# EAGLE design V3 (EAGLE 9.5.2)
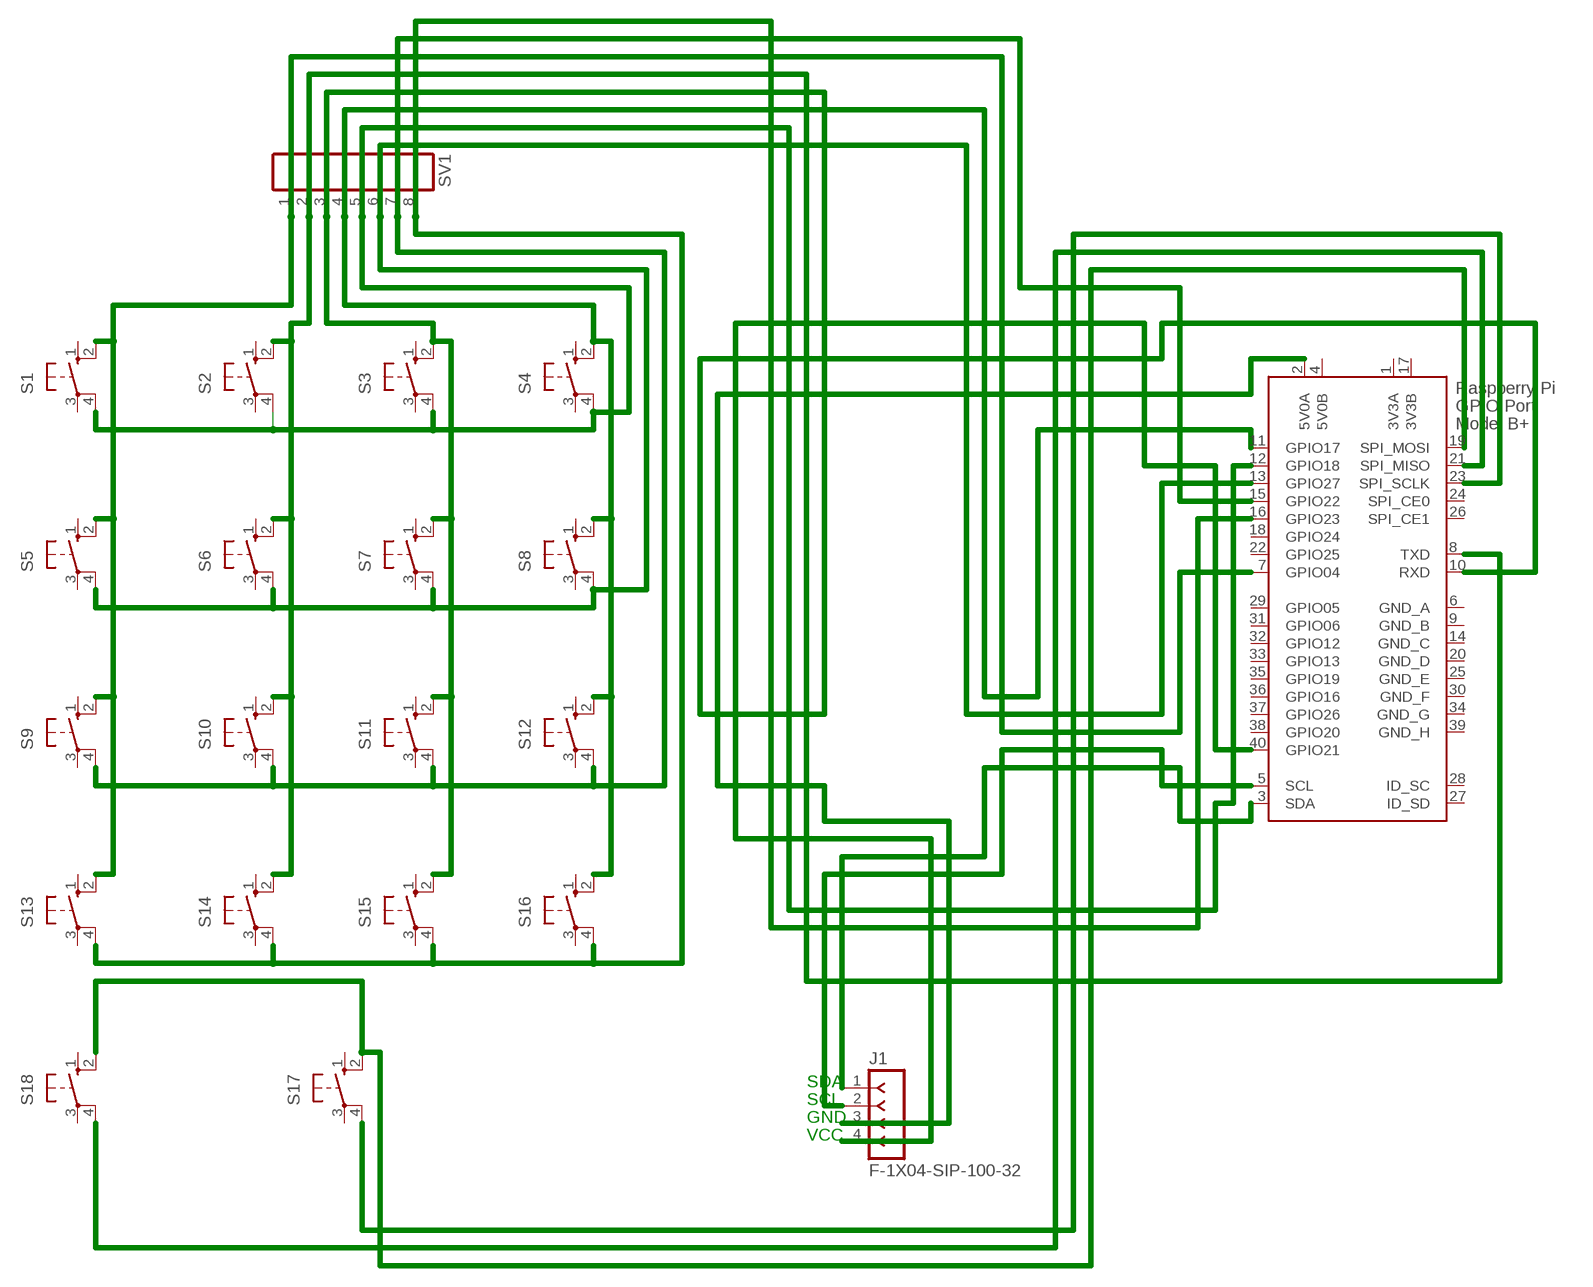
[diagram p0: schematic, sheet 1]

## Parts
J1  F-1X04-SIP-100-32  [SIP-100-04-32]
S1  40-XX  [B3F-40XX]
S2  40-XX  [B3F-40XX]
S3  40-XX  [B3F-40XX]
S4  40-XX  [B3F-40XX]
S5  40-XX  [B3F-40XX]
S6  40-XX  [B3F-40XX]
S7  40-XX  [B3F-40XX]
S8  40-XX  [B3F-40XX]
S9  40-XX  [B3F-40XX]
S10  40-XX  [B3F-40XX]
S11  40-XX  [B3F-40XX]
S12  40-XX  [B3F-40XX]
S13  40-XX  [B3F-40XX]
S14  40-XX  [B3F-40XX]
S15  40-XX  [B3F-40XX]
S16  40-XX  [B3F-40XX]
S17  40-XX  [B3F-40XX]
S18  40-XX  [B3F-40XX]
SV1  MA08-1  [MA08-1]
X1  RASPI_GPIO_B+#_PIN  [RASPI_GPIO_B+_PIN]

## Nets
N$1: S1.2(S1) S5.2(S1) S9.2(S1) S13.2(S1) SV1.1 X1.7(GPIO04)
N$2: S2.2(S1) S6.2(S1) S10.2(S1) S14.2(S1) SV1.2 X1.8(TXD)
N$3: S3.2(S1) S7.2(S1) S11.2(S1) S15.2(S1) SV1.3 X1.10(RXD)
N$4: J1.4 X1.40(GPIO21)
N$5: S13.4(P1) S14.4(P1) S15.4(P1) S16.4(P1) SV1.8 X1.16(GPIO23)
N$6: S9.4(P1) S10.4(P1) S11.4(P1) S12.4(P1) SV1.7 X1.15(GPIO22)
N$7: S5.4(P1) S6.4(P1) S7.4(P1) S8.4(P1) SV1.6 X1.13(GPIO27)
N$8: S1.4(P1) S2.4(P1) S3.4(P1) S4.4(P1) SV1.5 X1.12(GPIO18)
N$9: S17.2(S1) S18.2(S1) X1.19(SPI_MOSI)
N$10: S18.4(P1) X1.21(SPI_MISO)
N$11: S17.4(P1) X1.23(SPI_SCLK)
N$15: J1.1 X1.3(SDA)
N$16: J1.2 X1.5(SCL)
N$18: J1.3 X1.2(5V0A)
N$19: S4.2(S1) S8.2(S1) S12.2(S1) S16.2(S1) SV1.4 X1.11(GPIO17)
Unconnected: S1.1(S) S1.3(P) S2.1(S) S2.3(P) S3.1(S) S3.3(P) S4.1(S) S4.3(P) S5.1(S) S5.3(P) S6.1(S) S6.3(P) S7.1(S) S7.3(P) S8.1(S) S8.3(P) S9.1(S) S9.3(P) S10.1(S) S10.3(P) S11.1(S) S11.3(P) S12.1(S) S12.3(P) S13.1(S) S13.3(P) S14.1(S) S14.3(P) S15.1(S) S15.3(P) S16.1(S) S16.3(P) S17.1(S) S17.3(P) S18.1(S) S18.3(P) X1.18(GPIO24) X1.22(GPIO25) X1.24(SPI_CE0) X1.26(SPI_CE1) X1.27(ID_SD) X1.28(ID_SC) X1.29(GPIO05) X1.31(GPIO06) X1.32(GPIO12) X1.33(GPIO13) X1.35(GPIO19) X1.36(GPIO16) X1.37(GPIO26) X1.38(GPIO20)

## Notes on the sheet
- SDA
- SCL
- GND
- VCC

## Power pins joined to a net without a drawn wire
3V3A: X1.1(3V3A)
3V3B: X1.17(3V3B)
5V0B: X1.4(5V0B)
GND_A: X1.6(GND_A)
GND_B: X1.9(GND_B)
GND_C: X1.14(GND_C)
GND_D: X1.20(GND_D)
GND_E: X1.25(GND_E)
GND_F: X1.30(GND_F)
GND_G: X1.34(GND_G)
GND_H: X1.39(GND_H)

## Library data of the parts
J1 = con-headers-jp:F-1X04-: FEMALE HEADER
S1-S18 = switch-omron:40-XX: OMRON SWITCH; MF: OMRON COMPONENTS USA; MPN: B3F-4000; OC_FARNELL: 176434; OC_NEWARK: 36K3105
SV1 = con-lstb:MA08-1: PIN HEADER; OC_FARNELL: unknown; OC_NEWARK: unknown
X1 = raspberrypi_bastelstube_v13:RASPI_GPIO_B+#: 2x20 header connector, all pins connected

## Net classes
0 default: width 0.33 mm, clearance 0.33 mm

## Board
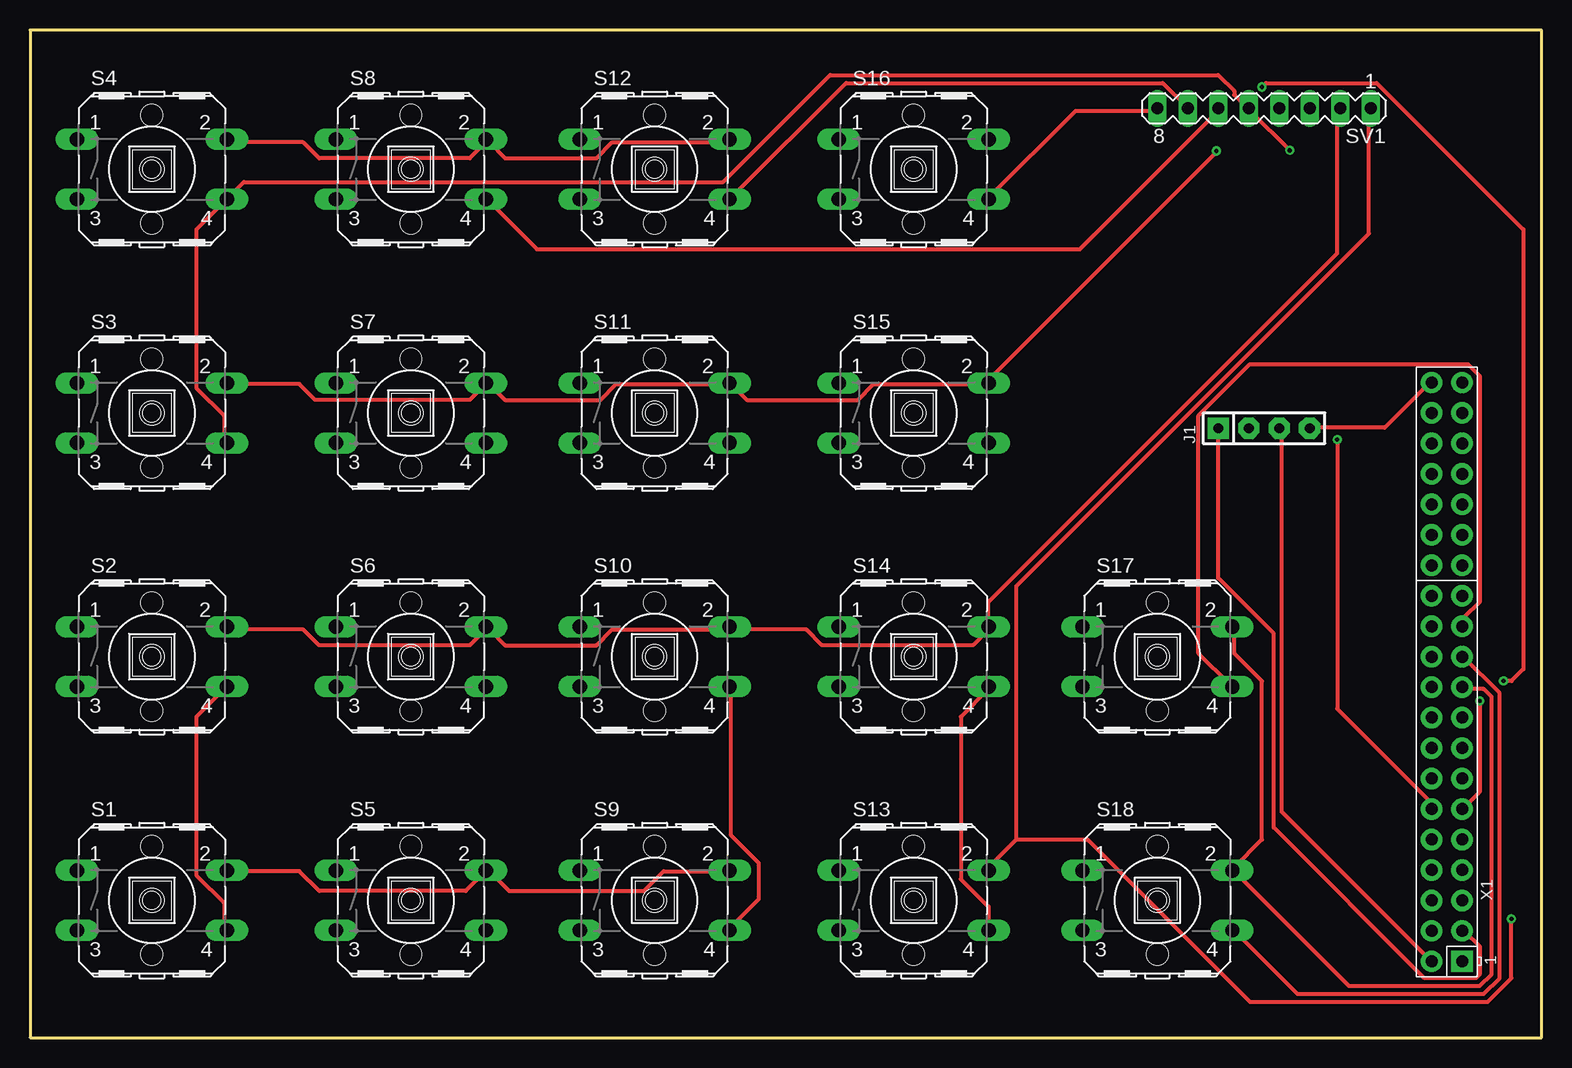
[diagram p1: board, top side]
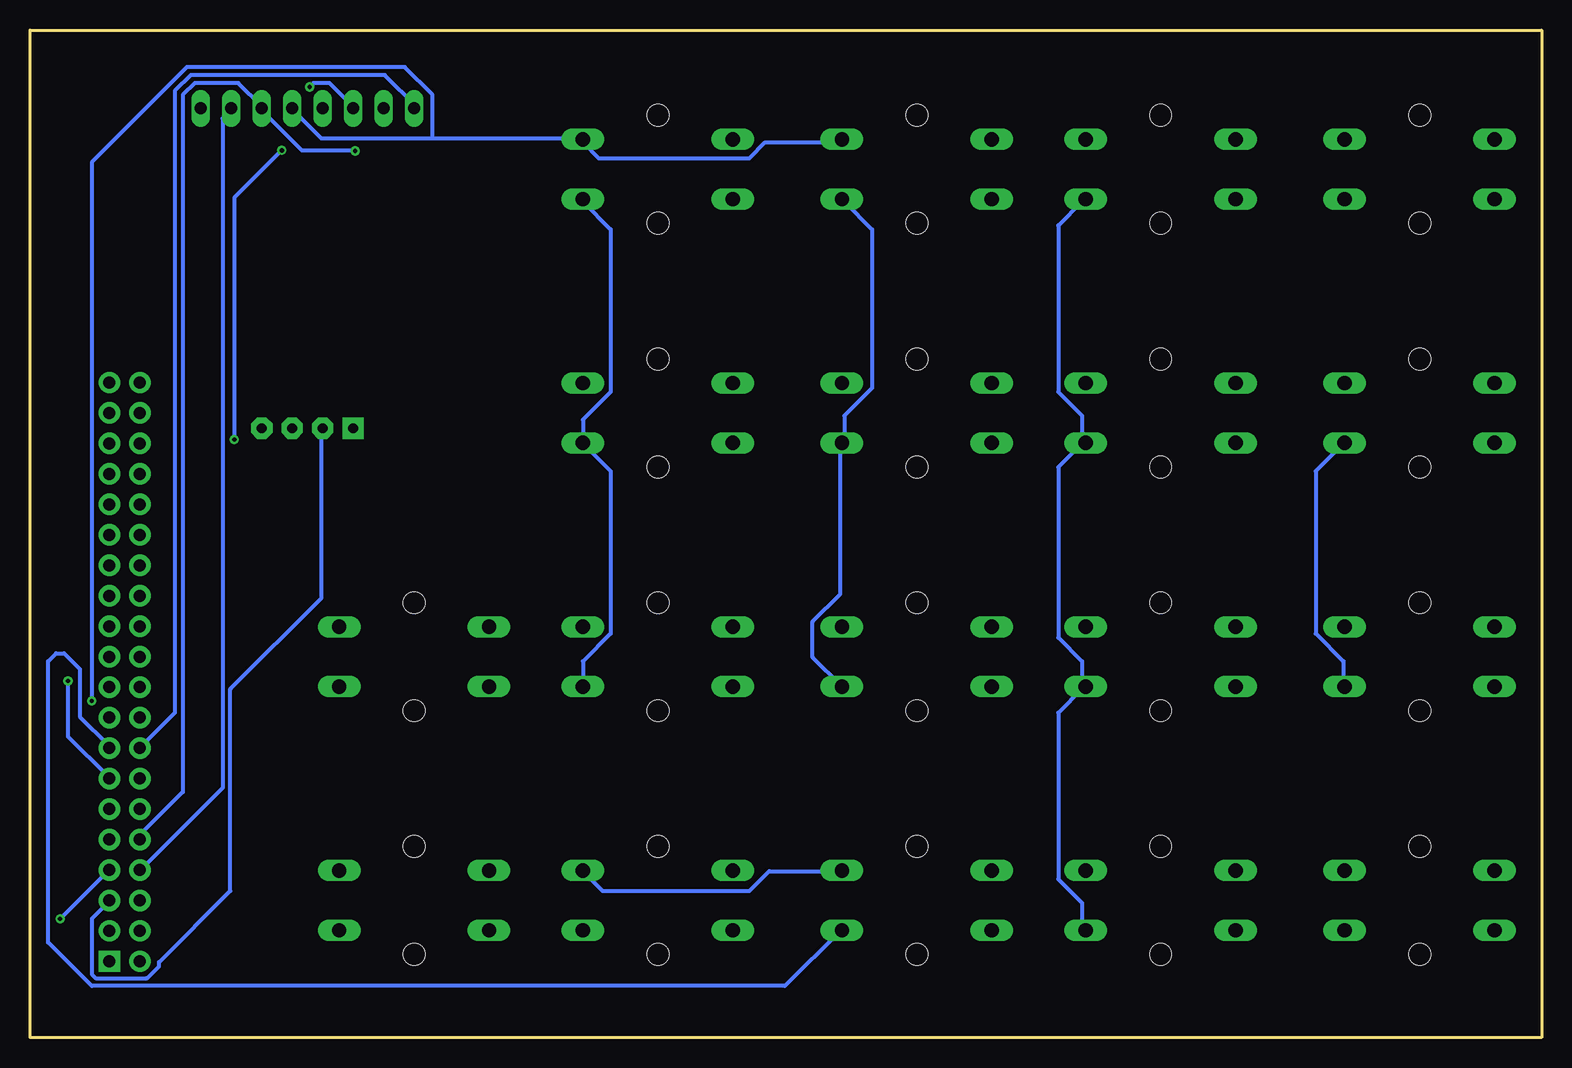
[diagram p2: board, bottom side, seen from below]

Size 126 x 84 mm. Coordinates in mm from the lower left corner, seen from the top.
Outline: 0,84 0,0 126,0 126,84 0,84
Copper layers (1*16): Top 0.035mm / dielectric 1.5mm / Bottom 0.035mm
Design rules "default *": minimum track width 6mil, minimum drill 0.35mm, track to track 13mil, track to pad 13mil, pad to pad 13mil, via to via 13mil, smd to smd 13mil, copper to edge 40mil, drill to drill 6mil, minimum pad ring 10mil, minimum via ring 8mil, stop-mask expansion 4mil, vias tented up to drill 0mil, thermal gap 10mil

### Footprints (pad centres in the part's own frame; a part is rotated, then mirrored left to right if it is on the bottom)
SIP-100-04-32 = drill 0.813 pad 1.778 square: 1 -3.81,0 | drill 0.813 pad 1.778 octagon: 2 -1.27,0; 3 1.27,0; 4 3.81,0
B3F-40XX = drill 1.194 long: 1 -6.248,2.489; 2 6.248,2.489; 3 -6.248,-2.489; 4 6.248,-2.489 | hole 1.803: 0,-4.496; 0,4.496
MA08-1 = drill 1.016 long: 1 -8.89,0; 2 -6.35,0; 3 -3.81,0; 4 -1.27,0; 5 1.27,0; 6 3.81,0; 7 6.35,0; 8 8.89,0
RASPI_GPIO_B+_PIN = drill 1 pad 1.778 square: 1 -24.13,-1.27 | drill 1 pad 1.778: 2 -24.13,1.27; 3 -21.59,-1.27; 4 -21.59,1.27; 5 -19.05,-1.27; 6 -19.05,1.27; 7 -16.51,-1.27; 8 -16.51,1.27; 9 -13.97,-1.27; 10 -13.97,1.27; 11 -11.43,-1.27; 12 -11.43,1.27; 13 -8.89,-1.27; 14 -8.89,1.27; 15 -6.35,-1.27; 16 -6.35,1.27; 17 -3.81,-1.27; 18 -3.81,1.27; 19 -1.27,-1.27; 20 -1.27,1.27; 21 1.27,-1.27; 22 1.27,1.27; 23 3.81,-1.27; 24 3.81,1.27; 25 6.35,-1.27; 26 6.35,1.27; 27 8.89,-1.27; 28 8.89,1.27; 29 11.43,-1.27; 30 11.43,1.27; 31 13.97,-1.27; 32 13.97,1.27; 33 16.51,-1.27; 34 16.51,1.27; 35 19.05,-1.27; 36 19.05,1.27; 37 21.59,-1.27; 38 21.59,1.27; 39 24.13,-1.27; 40 24.13,1.27

### Placement (x,y rotation side)
J1  102.87,50.8 0 top
S1  10.16,11.43 0 top
S2  10.16,31.75 0 top
S3  10.16,52.07 0 top
S4  10.16,72.39 0 top
S5  31.75,11.43 0 top
S6  31.75,31.75 0 top
S7  31.75,52.07 0 top
S8  31.75,72.39 0 top
S9  52.07,11.43 0 top
S10  52.07,31.75 0 top
S11  52.07,52.07 0 top
S12  52.07,72.39 0 top
S13  73.66,11.43 0 top
S14  73.66,31.75 0 top
S15  73.66,52.07 0 top
S16  73.66,72.39 0 top
S17  93.98,31.75 0 top
S18  93.98,11.43 0 top
SV1  102.87,77.47 180 top
X1  118.11,30.48 90 top

### Tracks (layer width: path | path; a pad name or v marks a point on that pad's centre or on a via)
N$1  (via drill 0.35)
  Top 0.33: S1.2 16.51,13.87 22.45,13.87 24.11,12.22 36.32,12.22 37.97,13.87 S5.2 38.3,13.87 39.95,12.22 51.18,12.22 52.83,13.87 58.12,13.87 S9.2 | 82.22,16.51 82.22,37.64 111.61,67.03 111.61,77.27 SV1.1 | 82.22,16.51 79.91,14.2 S13.2 | v123.5,9.91 123.5,4.95 121.51,2.97 101.7,2.97 88.16,16.51 82.22,16.51
  Bottom 0.33: v123.5,9.91 119.53,13.87 X1.7 | S9.2 58.45,13.87 64.39,13.87 66.04,12.22 78.26,12.22 79.91,13.87 S13.2
N$2
  Top 0.33: S2.2 16.51,34.01 22.78,34.01 24.11,32.69 36.65,32.69 37.97,34.01 S6.2 38.3,34.01 39.62,32.69 47.22,32.69 48.54,34.01 58.12,34.01 S10.2 58.45,34.01 64.72,34.01 66.04,32.69 78.59,32.69 79.91,34.01 S14.2 79.91,36.32 108.97,65.38 108.97,77.27 SV1.2
  Bottom 0.33: X1.8 116.56,14.2 109.96,20.8 109.96,76.61 109.3,77.27 SV1.2
N$3  (via drill 0.35)
  Top 0.33: S3.2 16.51,54.48 22.45,54.48 23.77,53.16 36.65,53.16 37.97,54.48 S7.2 38.3,54.48 39.62,53.16 47.55,53.16 48.87,54.48 58.12,54.48 S11.2 58.45,54.48 59.77,53.16 69.01,53.16 70.33,54.48 79.91,54.48 S15.2 79.91,54.81 98.73,73.64 v98.91,73.91
  Bottom 0.33: v98.91,73.91 99.06,73.97 103.35,73.97 106.66,77.27 SV1.3 106.66,77.6 108.64,79.58 112.27,79.58 113.26,78.59 113.26,20.47 116.56,17.17 116.56,16.51 X1.10
N$4
  Top 0.33: J1.4 106.98,50.85 112.93,50.85 116.56,54.48 X1.40
N$5
  Top 0.33: S13.4 79.91,10.9 77.6,13.21 77.6,26.75 79.91,29.06 S14.4 | SV1.8 93.78,77.27 87.17,77.27 79.91,70 S16.4
  Bottom 0.33: X1.16 116.56,24.43 113.92,27.08 113.92,78.92 112.6,80.24 96.42,80.24 93.78,77.6 SV1.8 | S16.4 79.91,69.67 77.6,67.36 77.6,53.82 79.91,51.51 S15.4 79.91,49.53 77.6,47.22 77.6,33.68 79.91,31.37 S14.4
N$6
  Top 0.33: SV1.7 96.42,77.6 94.44,79.58 68.02,79.58 58.45,70 S12.4 | S10.4 58.45,29.06 58.45,16.84 60.76,14.53 60.76,11.56 58.45,9.25 S9.4
  Bottom 0.33: S12.4 58.12,69.67 55.8,67.36 55.8,54.15 58.12,51.84 58.12,49.86 S11.4 58.45,49.53 58.45,36.98 60.76,34.67 60.76,31.7 S10.4 | X1.15 119.53,24.43 121.84,26.75 121.84,30.71 123.17,32.03 123.83,32.03 124.48,31.37 124.48,7.92 120.85,4.29 63.07,4.29 58.45,8.91 S9.4
N$7  (via drill 0.35)
  Top 0.33: SV1.6 99.06,77.27 87.5,65.71 42.27,65.71 38.3,69.67 S8.4 | v122.83,29.72 123.5,29.72 124.48,30.71 124.48,67.36 112.27,79.58 103.02,79.58 v102.69,79.25
  Bottom 0.33: S5.4 38.3,9.25 38.3,11.23 40.28,13.21 40.28,27.08 38.3,29.06 S6.4 38.3,29.39 38.3,31.37 40.28,33.35 40.28,47.55 38.3,49.53 S7.4 38.3,49.86 38.3,51.84 40.28,53.82 40.28,67.69 38.3,69.67 S8.4 | v122.83,29.72 122.83,25.09 119.53,21.79 X1.13 | v102.69,79.25 102.36,79.58 101.04,79.58 99.06,77.6 SV1.6
N$8  (via drill 0.35)
  Top 0.33: S1.4 16.18,9.25 16.18,11.23 13.87,13.54 13.87,26.75 16.18,29.06 S2.4 | v108.97,49.86 108.97,27.41 116.56,19.81 116.56,19.15 X1.12 | v105,73.97 101.7,77.27 SV1.5 101.37,77.6 100.38,78.59 100.38,78.92 99.06,80.24 66.7,80.24 57.78,71.32 17.83,71.32 S4.4 13.87,67.36 13.87,54.15 16.18,51.84 16.18,49.86 S3.4
  Bottom 0.33: v108.97,49.86 108.97,70 v105,73.97 | S2.4 16.51,29.39 16.51,31.37 18.82,33.68 18.82,47.22 16.51,49.53 S3.4
N$9
  Top 0.33: X1.19 119.53,29.06 121.18,29.06 121.84,28.4 121.84,5.28 120.85,4.29 109.96,4.29 100.38,13.87 S18.2 100.38,14.2 102.69,16.51 102.69,29.72 100.38,32.03 100.38,34.01 S17.2
N$10
  Top 0.33: X1.21 119.53,31.7 122.5,28.73 122.5,4.95 121.18,3.63 105.66,3.63 100.38,8.91 S18.4
N$11
  Top 0.33: X1.23 119.53,34.34 119.53,35 120.85,36.32 120.85,55.14 119.86,56.13 101.7,56.13 97.41,51.84 97.41,32.03 100.05,29.39 S17.4
N$15
  Top 0.33: J1.1 99.06,38.3 103.68,33.68 103.68,17.5 116.23,4.95 120.52,4.95 120.85,5.28 120.85,7.59 119.53,8.91 X1.3
N$16
  Bottom 0.33: J1.2 101.7,50.52 101.7,36.65 109.3,29.06 109.3,12.22 115.24,6.27 115.24,5.94 116.23,4.95 120.52,4.95 120.85,5.28 120.85,9.91 119.53,11.23 X1.5
N$18
  Top 0.33: J1.3 104.34,50.52 104.34,18.82 116.56,6.6 X1.2
N$19  (via drill 0.35)
  Top 0.33: S4.2 16.51,74.62 22.78,74.62 24.11,73.3 36.65,73.3 37.97,74.62 S8.2 38.3,74.62 39.62,73.3 47.22,73.3 48.54,74.62 58.12,74.62 S12.2 | v120.85,28.07 120.85,20.47 119.53,19.15 X1.11
  Bottom 0.33: 92.46,74.95 79.91,74.95 S16.2 79.91,74.62 78.59,73.3 66.04,73.3 64.72,74.62 58.45,74.62 S12.2 | 92.46,74.95 101.7,74.95 104.01,77.27 SV1.4 | v120.85,28.07 120.85,72.97 112.93,80.9 94.77,80.9 92.46,78.59 92.46,74.95